# Altium schematic sheet POWER_CN_BETTER.SchDoc
size 863 x 558 mm; SheetNumber: 7; SheetTotal: 7
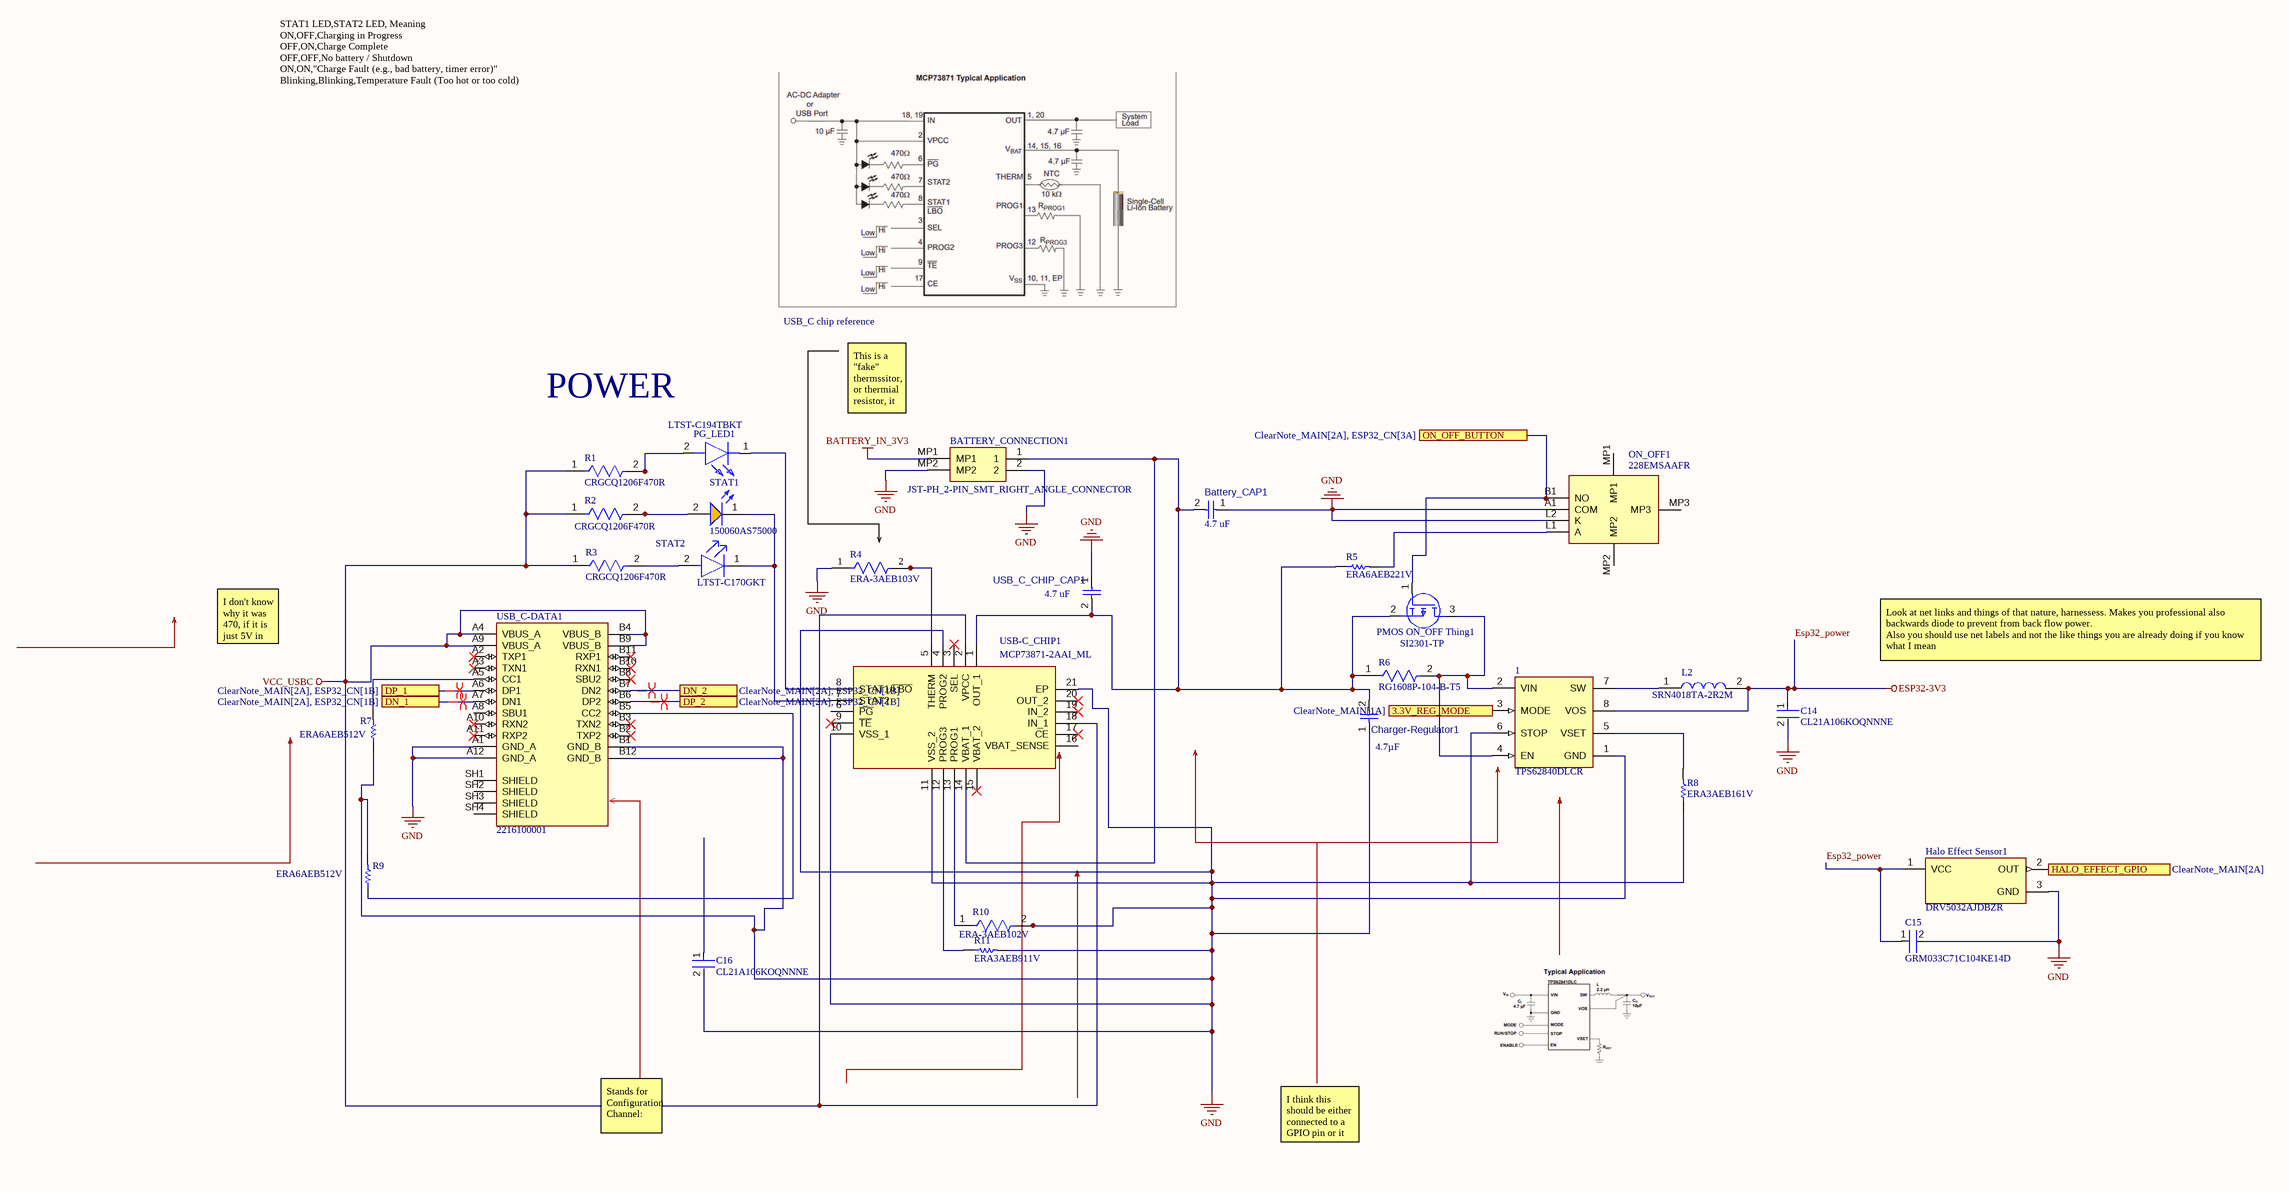
[diagram p0: POWER_CN_BETTER.SchDoc]

## Parts
1  TPS62840DLCR  [FP-DLC0008B-MFG]
Battery_CAP1  value 4.7 uF  [CAPC0402(1005)60_L]  (hidden comment: Capacitor 10µF +/-40% 6.3V 0402)
BATTERY_CONNECTION1  JST-PH_2-PIN_SMT_RIGHT_ANGLE_CONNECTOR  [JSTPH2PINSMTRIGHTANGLECONNECTOR]
C14  CL21A106KOQNNNE  [FP-CL21-IPC_B]
C15  GRM033C71C104KE14D  [FP-GRM033-0_03-MFG]
C16  CL21A106KOQNNNE  [FP-CL21-IPC_B]
Charger-Regulator1  value 4.7µF  [CAPC0603(1608)100_L]  (hidden comment: Capacitor 4.7µF +/-20% 10V 0603)
Halo_Effect_Sensor1  DRV5032AJDBZR  [FP-DBZ0003A-MFG]
L2  SRN4018TA-2R2M  [SRN4018TA2R2M]
ON_OFF1  228EMSAAFR  [228EMSAAFR]
PG_LED1  LTST-C194TBKT  [LEDC1608X35N]
PMOS_ON_OFF_Thing1  SI2301-TP  [SOT95P237X125-3N]
R1  CRGCQ1206F470R  [FP-CRGCQ1206-IPC_C]
R2  CRGCQ1206F470R  [FP-CRGCQ1206-IPC_C]
R3  CRGCQ1206F470R  [FP-CRGCQ1206-IPC_C]
R4  ERA-3AEB103V  [FP-ERA3A-IPC_C]
R5  ERA6AEB221V  [RESC2013X60X40NL20T25]
R6  RG1608P-104-B-T5  [FP-RG1608-IPC_A]
R7  ERA6AEB512V  [RESC2013X60X40LL20T25]
R8  ERA3AEB161V  [RESC1608X55X30ML20T20]
R9  ERA6AEB512V  [RESC2013X60X40LL20T25]
R10  ERA-3AEB102V  [FP-ERA3A-IPC_C]
R11  ERA3AEB911V  [RESC1608X55X30NL20T20]
STAT1  150060AS75000  [WL-SMCW_0603_150060xx75000]
STAT2  LTST-C170GKT  [FP-LTST-C170GKT-MFG]
USB-C_CHIP1  MCP73871-2AAI_ML  [QFN50P400X400X100-21N-D]
USB_C-DATA1  2216100001  [MOLEX_2216100001]
USB_C_CHIP_CAP1  value 4.7 uF  [CAPC0402(1005)60_L]  (hidden comment: Capacitor 10µF +/-40% 6.3V 0402)

## Ports
3.3V_REG_MODE (see ClearNote_MAIN[1A]), DN_1 (see ClearNote_MAIN[2A], ESP32_CN[1B]), DN_2 (see ClearNote_MAIN[2A], ESP32_CN[1B]), DP_1 (see ClearNote_MAIN[2A], ESP32_CN[1B]), DP_2 (see ClearNote_MAIN[2A], ESP32_CN[1B]), HALO_EFFECT_GPIO (see ClearNote_MAIN[2A]), ON_OFF_BUTTON (see ClearNote_MAIN[2A], ESP32_CN[3A])

## Nets
BATTERY_IN_3V3: BATTERY_CONNECTION1.MP1
Esp32_power: 1.8(VOS) C14.1 C15.1 Halo_Effect_Sensor1.1(VCC) L2.2  [also labelled ESP32-3V3]
GND: 1.1(GND) 1.6(STOP) Battery_CAP1.1 BATTERY_CONNECTION1.2 BATTERY_CONNECTION1.MP2 C14.2 C15.2 C16.2 Charger-Regulator1.1 Halo_Effect_Sensor1.3(GND) ON_OFF1.A1(COM) ON_OFF1.L2(K) R4.1 R7.1 R8.1 R9.2 R10.2 R11.2 USB-C_CHIP1.4(PROG2) USB-C_CHIP1.10(VSS_1) USB-C_CHIP1.11(VSS_2) USB-C_CHIP1.21(EP) USB_C-DATA1.A1(GND_A) USB_C-DATA1.A12(GND_A) USB_C-DATA1.B1(GND_B) USB_C-DATA1.B12(GND_B) USB_C_CHIP_CAP1.1
VCC_USBC: R1.1 R2.1 R3.1 USB-C_CHIP1.2(VPCC) USB-C_CHIP1.18(IN_1) USB_C-DATA1.A4(VBUS_A) USB_C-DATA1.A9(VBUS_A) USB_C-DATA1.B4(VBUS_B) USB_C-DATA1.B9(VBUS_B)
3.3V_REG_MODE: 1.3(MODE) ; port 3.3V_REG_MODE
DN_1: USB_C-DATA1.A7(DN1) ; port DN_1
DN_2: USB_C-DATA1.B7(DN2) ; port DN_2
DP_1: USB_C-DATA1.A6(DP1) ; port DP_1
DP_2: USB_C-DATA1.B6(DP2) ; port DP_2
HALO_EFFECT_GPIO: Halo_Effect_Sensor1.2(OUT) ; port HALO_EFFECT_GPIO
ON_OFF_BUTTON: ON_OFF1.B1(NO) PMOS_ON_OFF_Thing1.1(G) ; port ON_OFF_BUTTON
Net1_2: 1.2(VIN) 1.4(EN) PMOS_ON_OFF_Thing1.3(D) R6.2
Net1_5: 1.5(VSET) R8.2
Net1_7: 1.7(SW) L2.1
NetBattery_CAP1_2: Battery_CAP1.2 BATTERY_CONNECTION1.1 Charger-Regulator1.2 PMOS_ON_OFF_Thing1.2(S) R5.1 R6.1 USB-C_CHIP1.1(OUT_1) USB-C_CHIP1.14(VBAT_1) USB_C_CHIP_CAP1.2
NetON_OFF1_L1: ON_OFF1.L1(A) R5.2
NetPG_LED1_1: PG_LED1.1(K) USB-C_CHIP1.8(STAT1/~{LBO})
NetPG_LED1_2: PG_LED1.2(A) R1.2
NetR2_2: R2.2 STAT1.2(A)
NetR3_2: R3.2 STAT2.2(A)
NetR4_2: R4.2 USB-C_CHIP1.5(THERM)
NetR7_2: R7.2 USB_C-DATA1.A5(CC1)
NetR9_1: R9.1 USB_C-DATA1.B5(CC2)
NetR10_1: R10.1 USB-C_CHIP1.13(PROG1)
NetR11_1: R11.1 USB-C_CHIP1.12(PROG3)
NetSTAT1_1: STAT1.1(K) STAT2.1(C) USB-C_CHIP1.7(STAT2)

Not connected (* = marked no-connect by the designer): C16 1; ON_OFF1 MP1 MP2 MP3; USB-C_CHIP1 3(SEL)* 6(~{PG}) 9(~{TE})* 15(VBAT_2)* 16(VBAT_SENSE) 17(CE)* 19(IN_2)* 20(OUT_2)*; USB_C-DATA1 A2(TXP1)* A3(TXN1)* A8(SBU1) A10(RXN2)* A11(RXP2)* B2(TXP2)* B3(TXN2)* B8(SBU2)* B10(RXN1)* B11(RXP1)* SH1(SHIELD) SH2(SHIELD) SH3(SHIELD) SH4(SHIELD)

## Layout directives
differential pair: DN_1, DN_2, DP_1, DP_2

## Notes on the sheet
- STAT1 LED,STAT2 LED, Meaning
  ON,OFF,Charging in Progress
  OFF,ON,Charge Complete
  OFF,OFF,No battery / Shutdown
  ON,ON,"Charge Fault (e.g., bad battery, timer error)"
  Blinking,Blinking,Temperature Fault (Too hot or too cold)
- USB_C chip reference
- POWER
- This is a "fake" thermssitor, or thermial resistor, it should be plugged into a tempreatue sesnsor from the battery buut since there is none in the battery we can't put this into there so the thermial resistor can't change therefore not resisting the current of things.
- I don't know why it was 470, if it is just 5V in there should just be a calm 220 ohm, ion know
- Look at net links and things of that nature, harnessess. Makes you professional also backwards diode to prevent from back flow power.
  Also you should use net labels and not the like things you are already doing if you know what I mean
- Stands for Configuration Channel:
  Action for ClearNote: For your project, you just want to get the standard 5V from the USB-C port. To do this, you must tell the port you're a simple device. You do this by connecting a 5.1kΩ resistor from each of the two CC pins (CC1 and CC2) down to GND.
  This is critical: If you do not add these two 5.1kΩ pull-down resistors, a "smart" USB-C charger will not know what your device is and will not provide any power at all.
- I think this should be either connected to a GPIO pin or it can just be connected to the voltage
- I do not know as of right now weather or not this this has to be connected but it might either be a esp32 GPIO pin or a connection to the actual battery
- Maybe add a bypass capacito here, but I honestly don't think I need too and I think all the connections make sense as of right now
- DWG. NO.
- REV.
- SHT.
- REVISION
- DESCRIPTION
- DATE
- APPROVED
- THIS DOCUMENT AND THE DATA DISCLOSED HEREIN OR HEREWITH IS THE PROPERTY OF ALTIUM LIMITED AND MAY BE FREELY DISTRIBUTED IN WHOLE. NO RIGHTS ARE RESERVED OR EXPRESS OR IMPLIED WARANTEE GIVEN.
- ENG:
- DSN:
- APPROVALS
- PROJECT
- DOCUMENT REVISION:
- DESIGN ITEM:
- CHK:
- BOM:
- REFERENCE DOCUMENTS
- PROJECT REVISION:
- TITLE
- FAB DWG:
- PCB DWG:
- ASSY DWG:
- SCALE:
- SIZE
- D
- CAGE CODE
- FILE NAME
- DWG NO.
- SHEET
- OF
- REV

## Library data of the parts
1 = CMP-04918-000086-1: ULTRA LOW IQ BUCK CONVERTER; Manufacturer: Texas Instruments; Standoff Height: 0mm; Nominal Supply Current: 0.005-3000uA; Switching Frequency: 1.8MHz; Max Duty Cycle: 100%; Min Supply Voltage: 1.8V; Output Current: 750mA; Max Supply Voltage: 6.5V; Max Junction Temp: +125°C; Output Type: AdjustableProgrammable; Output Voltage: 1.8-3.3V; Number Of Outputs: 1; Device Class L1: Integrated Circuits (ICs); Device Class L3: Voltage Regulators - Switching; RoHS: TRUE; Automotive: No; Package: DLC0008B; ComponentLink2URL: http://www.ti.com/lit/ds/symlink/tps62840.pdf; Height: 1mm; Lead Free: Yes; Octopart: https://octopart.com/tps62840dlcr-texas+instruments-103121111; Mouser Description: 60-nA IQ, 1.8-V to 6.5-VIN, high-efficiency 750-mA step-down converter 8-VSON-HR -40 to 125; Manufacturer Part Number: TPS62840DLCR; Ipc Land Pattern Name: DFN200X150X100-8; Temperature: -40°C to +125°C; ComponentLink2Description: Datasheet; Switching Topology: Buck; Temperature Range Low: -40°C; Device Class L2: Power Management ICs; Temperature Range High: +125°C; Digikey Description: ULTRA LOW IQ BUCK CONVERTER; Category: IC
Battery_CAP1 USB_C_CHIP_CAP1 = CMP-001-00074-3: Chip Capacitor, 10µF +/-40%, 6.3V, 0402, Thickness 0.6 mm; Tolerance: 10%; Case/Package: 0402; Pins: 2; Mounting Technology: SMT; Voltage Rating: 6.3V; Max Operating Temperature: 85°C; Min Operating Temperature: -55°C
BATTERY_CONNECTION1 = JST-PH_2-PIN_SMT_RIGHT_ANGLE_CONNECTOR: Connector; Manufacturer_Name: 4UCON Technology; Manufacturer_Part_Number: JST-PH 2-PIN SMT RIGHT ANGLE CONNECTOR; Datasheet Link: https://cdn-shop.adafruit.com/datasheets/17311.pdf; Height: 5.7mm
C14 C16 = CMP-2000-06102-2: CL21 Series 0805 10uF 16V ±10% Tolerance X5R Multilayer Ceramic Chip Capacitor; Dielectric: X7R; Length: 2mm; Depth: 1.25mm; Voltage: 16V; Width: 0.049inch; Capacitance: 10uF; Lead Free: Lead Free; Max Operating Temperature: 85°C; Mount: Surface Mount; Voltage Rating: 16V; Height: 1.25mm; Radiation Hardening: No; Packaging: Tape and Reel; Voltage Rating (DC): 16V; Thickness: 0.055inch; Case/Package: 0805; Case Code (Imperial): 0805; Min Operating Temperature: -55°C; Case Code (Metric): 2012; Package Quantity: 1; Tolerance: 10%
C15 = CMP-06035-019037-1: Chip Multilayer Ceramic Capacitors for General Purpose, 0201, 0.10uF, X7S, 22%, 10%, 16V; Capacitance: 100nF; Dielectric: X7S; Tolerance: 10%; Voltage Rating (DC): 16V; Height: 0.3mm; Max Operating Temperature: 125°C; Case Code (Metric): 0603; Termination: SMD/SMT; Min Operating Temperature: -55°C; Mount: Surface Mount; Case/Package: 0201; Weight: 1.2E-05oz; Package Quantity: 15000; Length: 0.024inch; Voltage Rating: 16V; Case Code (Imperial): 0201; Packaging: Tape and Reel; Thickness: 0.013inch; Width: 0.3mm
Charger-Regulator1 = CMP-001-00076-4: Chip Capacitor, 4.7µF +/-20%, 10V, 0603, Thickness 1 mm; Tolerance: 10%; Mounting Technology: SMT; Case/Package: 0603; Pins: 2; Min Operating Temperature: -55°C; Max Operating Temperature: 85°C; Voltage Rating: 10V
Halo_Effect_Sensor1 = CMP-04937-000009-1: LP HALL 32AJDBZR/DNCR; Sensing Method: Hall Effect; Max Supply Current: 3.5uA; Max Output Current: 5mA; RoHS Compliant: Yes; Packaging: Cut Tape; Case/Package: TO-236-3; Max Operating Temperature: 85°C; Min Operating Temperature: -40°C
L2 = SRN4018TA-2R2M: Inductor; Manufacturer_Name: Bourns; Datasheet Link: https://www.bourns.com/docs/Product-Datasheets/SRN4018TA.pdf; Height: 1.8mm; Manufacturer_Part_Number: SRN4018TA-2R2M; Mouser Part Number: 652-SRN4018TA-2R2M; Mouser Price/Stock: https://www.mouser.co.uk/ProductDetail/Bourns/SRN4018TA-2R2M?qs=pxDZlBjcsCjtG44GfADDtw%3D%3D; Arrow Part Number: SRN4018TA-2R2M; Arrow Price/Stock: https://www.arrow.com/en/products/srn4018ta-2r2m/bourns?region=nac
ON_OFF1 = 228EMSAAFR: Switch; Manufacturer_Name: CTS; Datasheet Link: https://www.ctscorp.com/wp-content/uploads/228E.pdf; Height: 8.1mm; Manufacturer_Part_Number: 228EMSAAFR; Mouser Part Number: 774-228EMSAAFR; Mouser Price/Stock: https://www.mouser.co.uk/ProductDetail/CTS-Electronic-Components/228EMSAAFR?qs=BJlw7L4Cy79SBqPyuAl4qA%3D%3D
PG_LED1 = LTST-C194TBKT: LED; Manufacturer_Name: Lite-On; Datasheet Link: http://optoelectronics.liteon.com/upload/download/DS22-2010-0025/LTST-C194TBKT.PDF; Height: 0.35mm; Manufacturer_Part_Number: LTST-C194TBKT; Mouser Part Number: 859-LTST-C194TBKT; Mouser Price/Stock: https://www.mouser.co.uk/ProductDetail/Lite-On/LTST-C194TBKT?qs=xIkB7y1OToppqaeT0gFDew%3D%3D; Arrow Part Number: LTST-C194TBKT; Arrow Price/Stock: https://www.arrow.com/en/products/ltst-c194tbkt/lite-on-technology?utm_currency=USD&region=nac
PMOS_ON_OFF_Thing1 = SI2301-TP: MOSFET (P-Channel); Manufacturer_Name: MCC; Datasheet Link: https://mccsemi.com/pdf/Products/SI2301(SOT-23).pdf; Height: 1.25mm; Manufacturer_Part_Number: SI2301-TP; Mouser Part Number: 833-SI2301-TP; Mouser Price/Stock: https://www.mouser.co.uk/ProductDetail/Micro-Commercial-Components-MCC/SI2301-TP?qs=SdqRYZZ9IxDQZSN6dfdoAA%3D%3D; Arrow Part Number: SI2301-TP; Arrow Price/Stock: https://www.arrow.com/en/products/si2301-tp/micro-commercial-components?utm_currency=USD&region=nac
R1-R3 = CMP-03211-011147-1: CRGCQ 1206 470R 1%; Manufacturer: TE Connectivity; Power Rating: 0.25W; Tolerance: 0.01; Automotive Grade: Grade 609; Voltage Rating: 200V; Resistance: 470Ω; Temperature Coefficient: ±100ppm/°C; Value: 470Ω; Octopart: https://octopart.com/crgcq1206f470r-te+connectivity-91018284; Manufacturer Part Number: CRGCQ1206F470R; ComponentLink2Description: Datasheet; Device Class L3: Chip SMD Resistors; Temperature Range High: +155°C; Device Class L1: Passive Components; Ipc Land Pattern Name: RESC310155X55; Ambient Temperature Range High: +70°C; RoHS: TRUE; Series: CRGCQ; Height: 0.65mm; Digikey Description: CRGCQ 1206 470R 1%; Package: CRGCQ1206; Composition: Thick Film; Lead Free: Yes; Automotive: Yes; Category: Res; Temperature Range Low: -55°C; ComponentLink2URL: https://www.te.com/commerce/DocumentDelivery/DDEController?Action=showdoc&DocId=Data+Sheet%7F1773204-3%7F1%7Fpdf%7FEnglish%7FENG_DS_1773204-3_1.pdf%7F4-2176347-618; Device Class L2: Resistors; Temperature: -55°C to +155°C; Mouser Description: Res General Purpose Thick Film 1206 470 Ohm 1% 1/4W ±100ppm/°C Molded Paper T/R
R4 = CMP-2000-00874-2: RES SMD 10K OHM 0.1% 1/10W 0603; Voltage Rating (DC): 75V; Power Rating: 100mW; Resistance: 10kR; Temperature Coefficient: 25ppm/°C; Radiation Hardening: No; Width: 0.8mm; Depth: 0.8mm; Construction: Rectangular; Case Code (Metric): 1608; Package Quantity: 5000; Length: 1.6mm; Size Code: 0603; Case Code (Imperial): 0603; Termination: SMD/SMT; Contact Plating: Tin; Resistance Tolerance: 0.1%; Military Standard: Not; Packaging: Tape and Reel; Max Power Dissipation: 100mW; REACH SVHC: No SVHC; Series: ERA-3A; Voltage Rating: 75V; Lead Free: Lead Free; Technology: METAL FILM; RoHS Compliant: Yes; Max Operating Temperature: 155°C; Resistor Type: Thin Film; Min Operating Temperature: -55°C; Number of Pins: 2; Case/Package: 0603; Tolerance: 0.1%; Height: 0.45mm; Mount: Surface Mount; Number of Terminations: 2
R5 = CMP-2001-00612-1: Manufacturer: Panasonic; Part Number: ERA6AEB221V
R6 = CMP-2000-01971-2: Automotive Metal Thin Film Chip Resistor, 0603, 100kΩ, 0.1%, 25ppm/°C, 0.1W, 100V; Resistance: 100kR; Max Power Dissipation: 100mW; Voltage Rating (DC): 75V; RoHS Compliant: Yes; Case/Package: 0603; Lead Free: Lead Free; Case Code (Imperial): 0603; Number of Terminations: 2; Series: RG; Packaging: Tape and Reel; Case Code (Metric): 1608; Working Voltage: 100V; Height: 0.02inch; Termination: SMD/SMT; Technology: THIN FILM; Power Rating: 100mW; Min Operating Temperature: -55°C; Resistor Type: Thin Film; Temperature Coefficient: 25ppm/°C; Weight: 7.1E-05oz; Max Operating Temperature: 155°C; Tolerance: 0.1%; Length: 0.063inch; Features: Automotive AEC-Q200; Voltage Rating: 100V; Package Quantity: 1; Width: 0.031inch
R7 R9 = CMP-2001-00649-1: Manufacturer: Panasonic; Part Number: ERA6AEB512V
R8 = CMP-2000-00921-1: Manufacturer: Panasonic; Part Number: ERA3AEB161V
R10 = CMP-2000-00873-2: RES SMD 1K OHM 0.1% 1/10W 0603; Temperature Coefficient: 25ppm/°C; Voltage Rating: 75V; Max Power Dissipation: 100mW; Resistance: 1kR; Technology: METAL FILM; Number of Pins: 2; Packaging: Tape and Reel; Case Code (Imperial): 0603; Case Code (Metric): 1608; Min Operating Temperature: -55°C; REACH SVHC: No SVHC; Length: 1.6mm; Termination: SMD/SMT; Depth: 0.8mm; Resistance Tolerance: 0.1%; Number of Terminations: 2; Width: 0.8mm; Military Standard: Not; Tolerance: 0.1%; Package Quantity: 5000; Contact Plating: Tin; Height: 0.45mm; Construction: Rectangular; Case/Package: 0603; Max Operating Temperature: 155°C; Resistor Type: Thin Film; Series: ERA-3A; Size Code: 0603; RoHS Compliant: Yes; Mount: Surface Mount; Radiation Hardening: No; Power Rating: 100mW
R11 = CMP-2000-00139-1: Manufacturer: Panasonic; Part Number: ERA3AEB911V
STAT1 = CMP-03913-89970694-2: WL-SMCW SMT Mono-Color Chip LED Waterclear; Luminous Intensity: 130mcd; Max Reverse Voltage (DC): 5V; Viewing Angle: 140°; Dominant Wavelength: 605nm; Forward Current: 100mA; Forward Voltage: 2V; Peak Wavelength: 610nm; RoHS: Compliant; Min Operating Temperature: -40°C; Wavelength: 605nm; Max Operating Temperature: 85°C; Packaging: Tape and Reel
STAT2 = CMP-1674-00002-6: LED GREEN CLEAR SMD; Dominant Wavelength: 569nm; Lens Style: Diffused; Forward Voltage: 2.1V; Number of Elements: 1; Wavelength: 565nm; Luminous Intensity: 6mcd; Test Current: 10mA; Power Dissipation: 100mW; Reverse Voltage: 5V; Forward Current: 30mA; Viewing Angle: 130°; Lens Color: Colorless; Min Operating Temperature: -55°C; Number of Pins: 2; Max Operating Temperature: 85°C; Color: Green; Radiation Hardening: No; Illumination Color: Green; Case Code (Metric): 2012; Lens Transparency: Clear; Case/Package: 0805; Width: 1.25mm; Case Code (Imperial): 0805; Package Quantity: 1; Height: 1.1mm; Depth: 1.25mm; Length: 2mm; Power Rating: 100mW; Lead Free: Lead Free; Number of LEDs: 1; Packaging: Tape and Reel; Mount: Surface Mount; Voltage: 5V
USB-C_CHIP1 = MCP73871-2AAI_ML: Integrated Circuit; Manufacturer_Name: Microchip; Manufacturer_Part_Number: MCP73871-2AAI/ML; Datasheet Link: https://datasheet.datasheetarchive.com/originals/distributors/Datasheets-DGA15/728881.pdf; Height: 1mm; Mouser Part Number: 579-MCP73871-2AAI/ML; Mouser Price/Stock: https://www.mouser.co.uk/ProductDetail/Microchip-Technology/MCP73871-2AAI-ML?qs=qXsUupcbpXytQbuW7QCczA%3D%3D; Arrow Part Number: MCP73871-2AAI/ML; Arrow Price/Stock: https://www.arrow.com/en/products/mcp73871-2aaiml/microchip-technology?utm_currency=USD&region=nac
USB_C-DATA1 = 2216100001: USB-C (USB TYPE-C) Receptacle Connector 24 Position Surface Mount, Right Angle; MF: Molex; SnapEDA_Link: https://www.snapeda.com/parts/2216100001/Molex/view-part/?ref=snap; Package: None; Value: *; MP: 2216100001; Check_prices: https://www.snapeda.com/parts/2216100001/Molex/view-part/?ref=eda